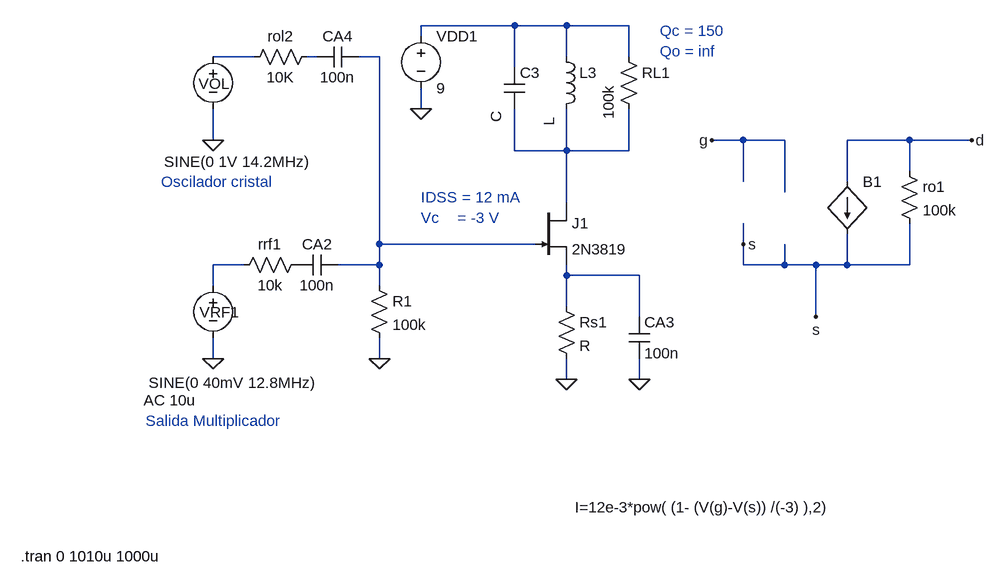
[diagram p0: schematic mixer.asc]
mixer.asc, the LTspice schematic file:
Version 4
SHEET 1 1160 680
WIRE 368 -336 224 -336
WIRE 448 -336 368 -336
WIRE 544 -336 448 -336
WIRE 224 -320 224 -336
WIRE -32 -288 -96 -288
WIRE 64 -288 48 -288
WIRE 160 -288 128 -288
WIRE 448 -288 448 -336
WIRE 544 -288 544 -336
WIRE 368 -272 368 -336
WIRE 224 -208 224 -240
WIRE -96 -160 -96 -208
WIRE 720 -160 672 -160
WIRE 784 -160 720 -160
WIRE 976 -160 880 -160
WIRE 1072 -160 976 -160
WIRE 368 -144 368 -208
WIRE 448 -144 448 -208
WIRE 448 -144 368 -144
WIRE 544 -144 544 -208
WIRE 544 -144 448 -144
WIRE 976 -112 976 -160
WIRE 720 -96 720 -160
WIRE 880 -96 880 -160
WIRE 784 -80 784 -160
WIRE 448 -64 448 -144
WIRE 160 0 160 -288
WIRE 400 0 160 0
WIRE 720 0 720 -32
WIRE -48 32 -96 32
WIRE 160 32 160 0
WIRE 160 32 96 32
WIRE 720 32 720 0
WIRE 784 32 784 0
WIRE 784 32 720 32
WIRE 832 32 784 32
WIRE 880 32 880 -16
WIRE 880 32 832 32
WIRE 976 32 976 -32
WIRE 976 32 880 32
WIRE 448 48 448 32
WIRE 560 48 448 48
WIRE -96 64 -96 32
WIRE 160 64 160 32
WIRE 448 96 448 48
WIRE 560 112 560 48
WIRE 832 112 832 32
WIRE -96 176 -96 144
WIRE 160 176 160 144
WIRE 448 208 448 176
WIRE 560 208 560 176
FLAG 448 208 0
FLAG -96 176 0
FLAG 672 -160 g
FLAG 720 0 s
FLAG 560 208 0
FLAG 224 -208 0
FLAG 1072 -160 d
FLAG -96 -160 0
FLAG 832 112 s
FLAG 160 176 0
SYMBOL res 48 16 R90
WINDOW 0 0 56 VBottom 2
WINDOW 3 32 56 VTop 2
SYMATTR InstName rrf1
SYMATTR Value 10k
SYMBOL cap 96 16 R90
WINDOW 0 0 32 VBottom 2
WINDOW 3 32 32 VTop 2
SYMATTR InstName CA2
SYMATTR Value 100n
SYMBOL bi 880 -96 R0
WINDOW 3 -419 501 Left 2
SYMATTR Value I=12e-3*pow( (1- (V(g)-V(s)) /(-3) ),2)
SYMATTR InstName B1
SYMBOL ind 432 -304 R0
WINDOW 3 -11 122 VLeft 2
SYMATTR InstName L3
SYMBOL res 960 -128 R0
SYMATTR InstName ro1
SYMATTR Value 100k
SYMBOL cap 352 -272 R0
WINDOW 3 -12 85 VLeft 2
SYMATTR InstName C3
SYMBOL res 528 -304 R0
WINDOW 3 -15 112 VLeft 2
SYMATTR Value 100k
SYMATTR InstName RL1
SYMBOL voltage -96 48 R0
WINDOW 123 -107 192 Left 2
WINDOW 39 0 0 Left 0
WINDOW 0 -21 57 Left 2
WINDOW 3 -99 165 Left 2
SYMATTR Value2 AC 10u
SYMATTR InstName VRF1
SYMATTR Value SINE(0 40mV 12.8MHz)
SYMBOL res 432 80 R0
SYMATTR InstName Rs1
SYMBOL cap 544 112 R0
SYMATTR InstName CA3
SYMATTR Value 100n
SYMBOL voltage 224 -336 R0
WINDOW 123 0 0 Left 0
WINDOW 39 0 0 Left 0
SYMATTR InstName VDD1
SYMATTR Value 9
SYMBOL cap 128 -304 R90
WINDOW 0 0 32 VBottom 2
WINDOW 3 32 32 VTop 2
SYMATTR InstName CA4
SYMATTR Value 100n
SYMBOL voltage -96 -304 R0
WINDOW 123 0 0 Left 0
WINDOW 39 0 0 Left 0
WINDOW 0 -22 57 Left 2
WINDOW 3 -75 177 Left 2
SYMATTR InstName VOL
SYMATTR Value SINE(0 1V 14.2MHz)
SYMBOL res 64 -304 R90
WINDOW 0 0 56 VBottom 2
WINDOW 3 32 56 VTop 2
SYMATTR InstName rol2
SYMATTR Value 10K
SYMBOL njf 400 -64 R0
SYMATTR InstName J1
SYMATTR Value 2N3819
SYMBOL res 144 48 R0
SYMATTR InstName R1
SYMATTR Value 100k
TEXT -392 480 Left 2 !.tran 0 1010u 1000u
TEXT -176 -96 Left 2 ;Oscilador cristal
TEXT -200 272 Left 2 ;Salida Multiplicador
TEXT 224 -72 Left 2 ;IDSS = 12 mA\nVc    = -3 V
TEXT 592 -328 Left 2 ;Qc = 150\nQo = inf

The netlist it stands for:
* mixer.asc
rrf1 P001 N006 10k
CA2 N004 P001 100n
B1 d s I=12e-3*pow( (1- (V(g)-V(s)) /(-3) ),2)
L3 N001 N005 L
ro1 d s 100k
C3 N001 N005 C
RL1 N001 N005 100k
VRF1 N006 0 SINE(0 40mV 12.8MHz) AC 10u
Rs1 N007 0 R
CA3 N007 0 100n
VDD1 N001 0 9
CA4 N004 N003 100n
VOL N002 0 SINE(0 1V 14.2MHz)
rol2 N003 N002 10K
J1 N005 N004 N007 2N3819
R1 N004 0 100k
.model NJF NJF
.model PJF PJF
.lib standard.jft
.tran 0 1010u 1000u
* Oscilador cristal
* Salida Multiplicador
* IDSS = 12 mA
* Vc    = -3 V
* Qc = 150
* Qo = inf
.backanno
.end